# EAGLE schematic WirelessSensorPacket - Copy (EAGLE 6.4)

## Sheet 1 of 4

## Sheet 2 of 4
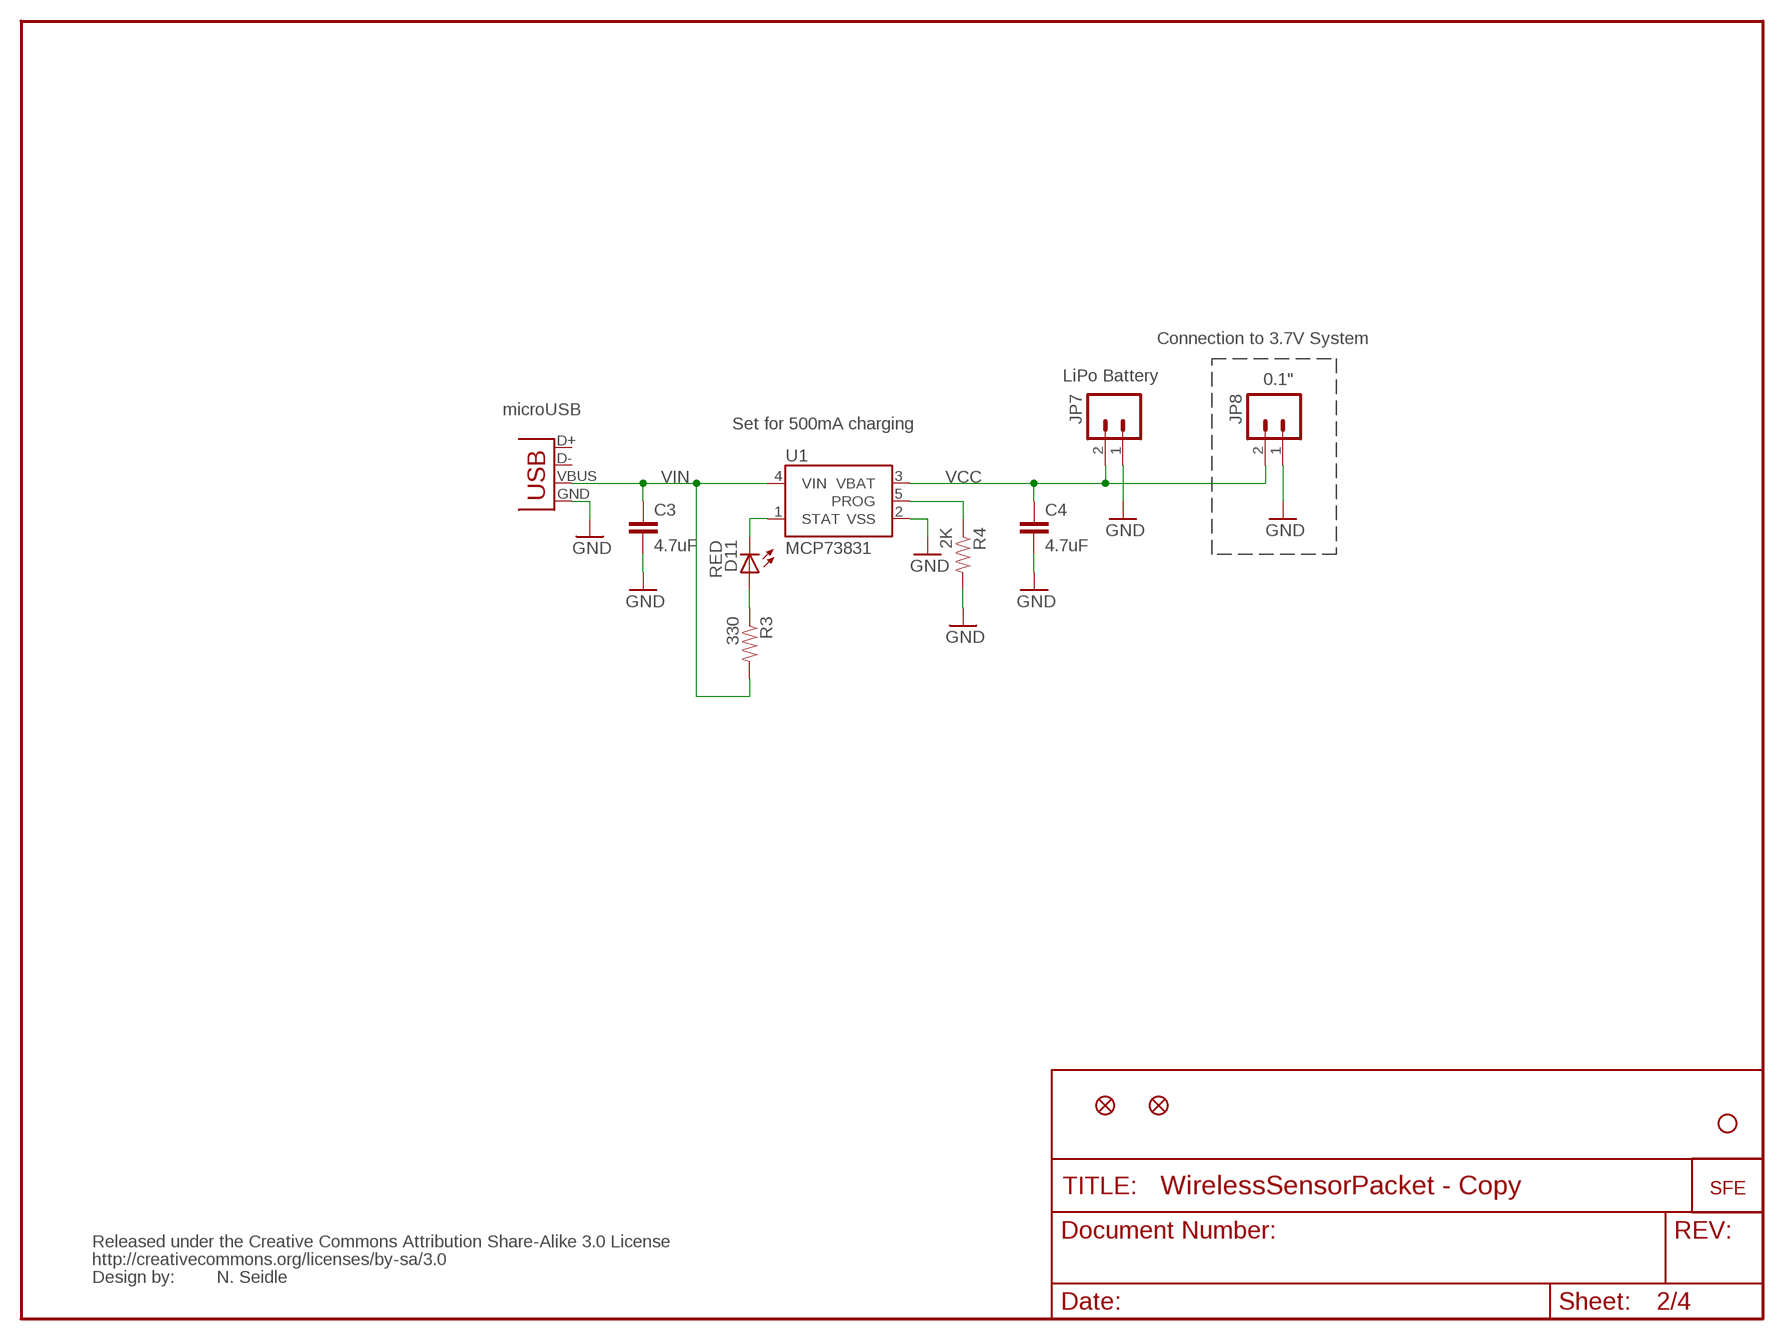
[diagram p0: schematic, sheet 2]

### Parts
C3  4.7uF  CAP0402-CAP  [0402-CAP]
C4  4.7uF  CAP0402-CAP  [0402-CAP]
D11  RED  LED0603  [LED-0603]
JP1  LOGO-SFESK  [SFE-LOGO-FLAME]
JP2  STAND-OFF  [STAND-OFF]
JP3  FIDUCIAL1X2  [FIDUCIAL-1X2]
JP4  FIDUCIAL1X2  [FIDUCIAL-1X2]
JP7  LiPo Battery  M02-JST-2MM-SMT  [JST-2-SMD]
JP8  M02PTH  [1X02]
R3  330  RESISTOR0402-RES  [0402-RES]
R4  2K  RESISTOR0402-RES  [0402-RES]
U1  MCP73831  [SOT23-5]
U$1  CREATIVE_COMMONS  [CREATIVE_COMMONS]
X1  Micro USB  USB-MICROB  [USB-MICROB]

### Nets
GND: C3.2 C4.2 JP7.1 JP8.1 R4.2 U1.2(VSS) X1.GND ; also sheet 3,4
N$3: D11.A R3.1
PROG: R4.1 U1.5(PROG)
STAT: D11.C U1.1(STAT)
VCC: C4.1 JP7.2 JP8.2 U1.3(VBAT)
VIN: C3.1 R3.2 U1.4(VIN) X1.VBUS
Unconnected: X1.D+ X1.D-

### Notes on the sheet
- Connection to 3.7V System
- 0.1"
- microUSB
- Set for 500mA charging
- N. Seidle

## Sheet 3 of 4
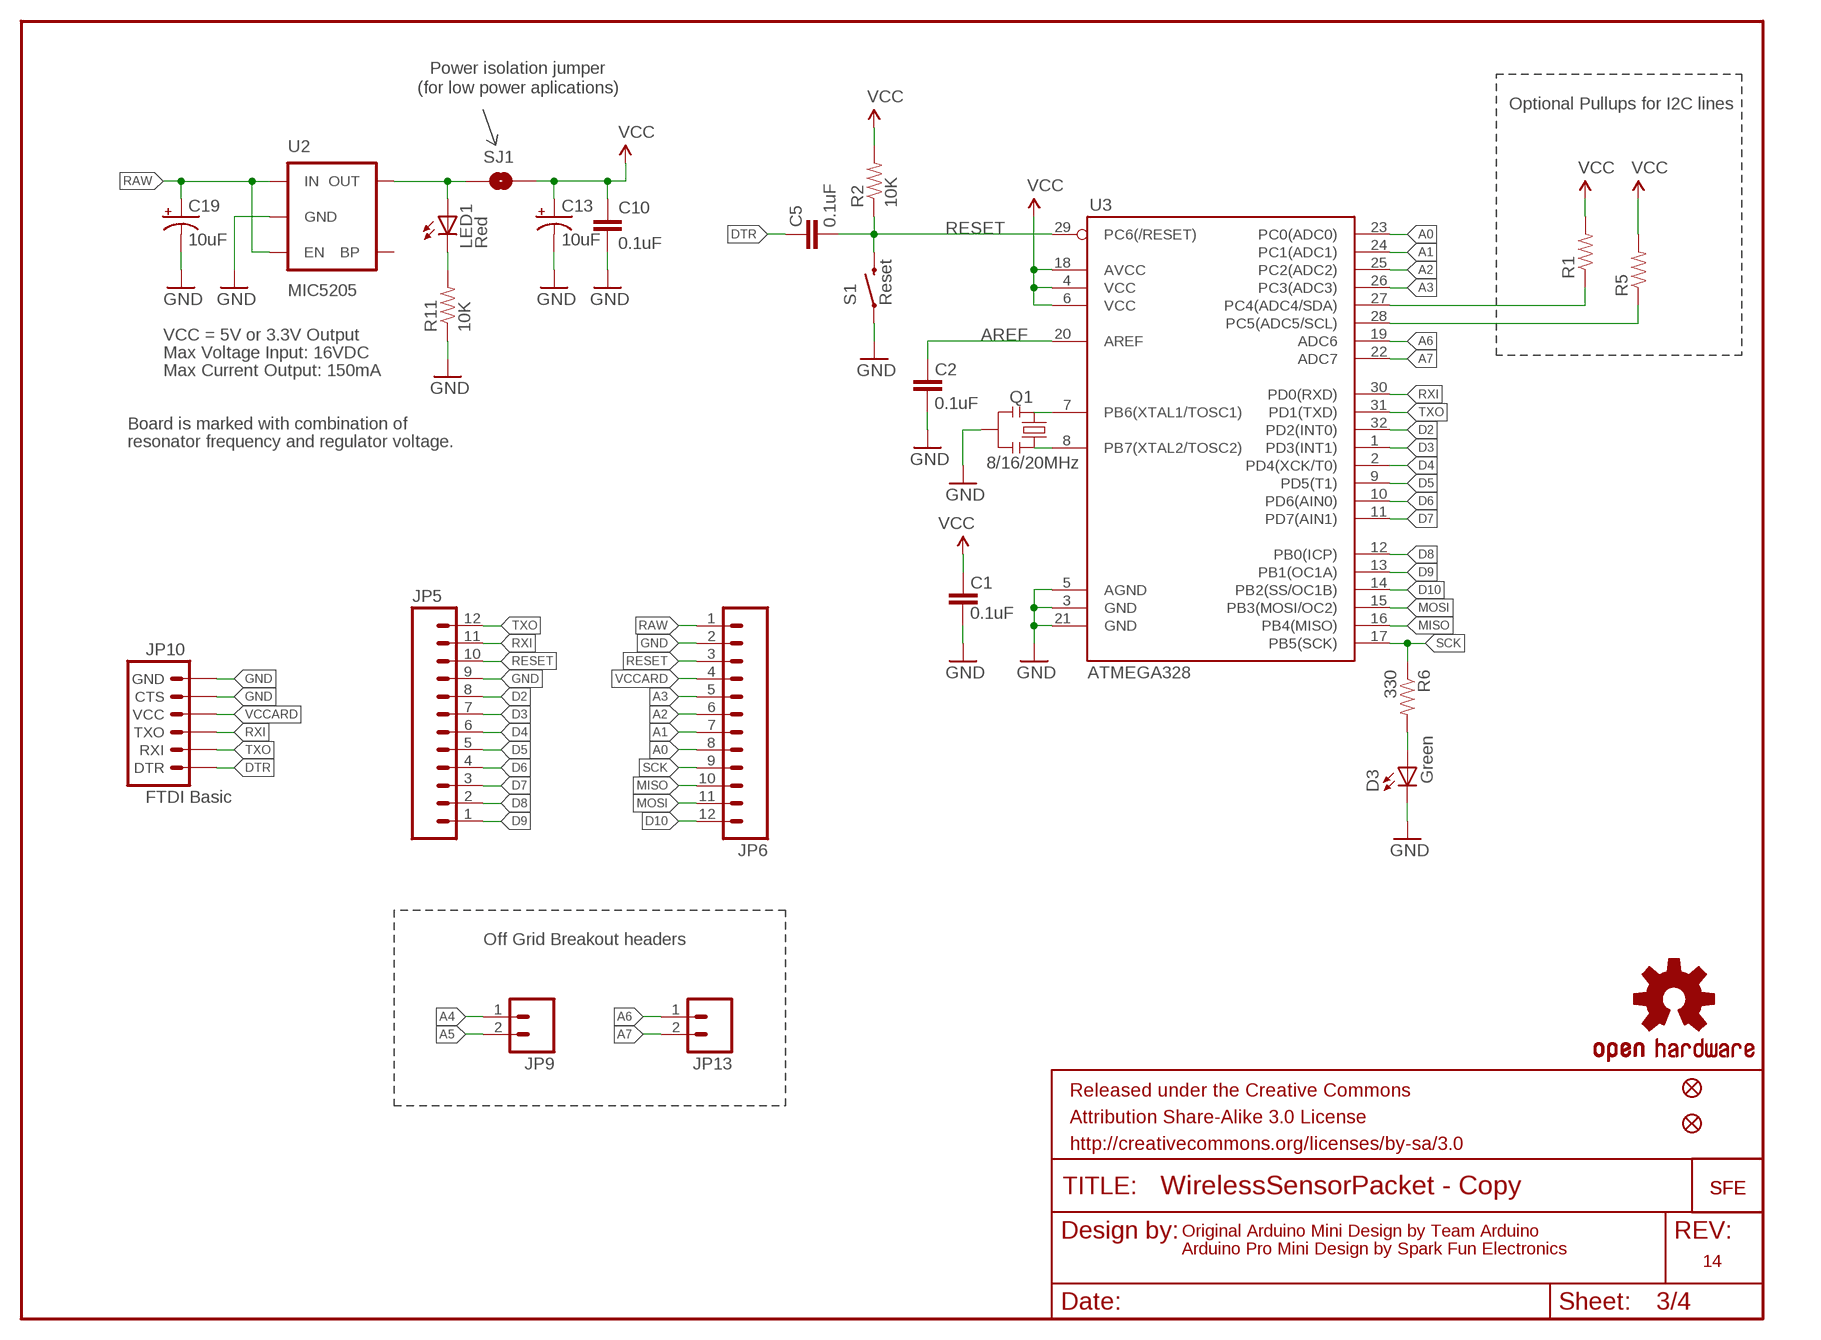
[diagram p1: schematic, sheet 3]

### Parts
C1  0.1uF  CAP0603-CAP  [0603-CAP]
C2  0.1uF  CAP0603-CAP  [0603-CAP]
C5  0.1uF  CAP0603-CAP  [0603-CAP]
C10  0.1uF  CAP0603-CAP  [0603-CAP]
C13  10uF  CAP_POL1206  [EIA3216]
C19  10uF  CAP_POL1206  [EIA3216]
D3  Green  LED  [0603-LED-ALT1]
JP5  M12PTH  [1X12]
JP6  M12PTH  [1X12]
JP9  M02PTH  [1X02]
JP10  FTDI Basic  ARDUINO_SERIAL_PROGRAMPTH  [1X06]
JP11  FIDUCIALUFIDUCIAL  [MICRO-FIDUCIAL]
JP12  FIDUCIALUFIDUCIAL  [MICRO-FIDUCIAL]
JP13  M02PTH  [1X02]
LED1  Red  LED  [0603-LED-ALT1]
Q1  8/16/20MHz  RESONATOR1:1  [RESONATOR-SMD-1:1]
R1  RESISTOR0603-RES  [0603-RES]
R2  10K  RESISTOR0603-RES  [0603-RES]
R5  RESISTOR0603-RES  [0603-RES]
R6  330  RESISTOR0603-RES  [0603-RES]
R11  10K  RESISTOR0603-RES  [0603-RES]
S1  Reset  SWITCH-MOMENTARY-2SMD-ALT01  [TACTILE-SWITCH-SMD-ALT01]
SJ1  SOLDERJUMPERNC  [SJ_2S]
U2  MIC5205  V_REG_LDOSMD  [SOT23-5]
U3  ATMEGA328  ATMEGA168  [TQFP32-08]
U$2  LOGO-SFESK  [SFE-LOGO-FLAME]
U$3  OSHW-LOGOS  [OSHW-LOGO-S]
U$11  LOGO-SFENEW  [SFE-NEW-WEBLOGO]

### Nets
A0: JP6.8 U3.23(PC0(ADC0))
A1: JP6.7 U3.24(PC1(ADC1))
A2: JP6.6 U3.25(PC2(ADC2))
A3: JP6.5 U3.26(PC3(ADC3))
A4: JP9.1 R1.1 U3.27(PC4(ADC4/SDA))
A5: JP9.2 R5.1 U3.28(PC5(ADC5/SCL))
A6: JP13.1 U3.19(ADC6)
A7: JP13.2 U3.22(ADC7)
AREF: C2.2 U3.20(AREF)
D2: JP5.8 U3.32(PD2(INT0))
D3: JP5.7 U3.1(PD3(INT1))
D4: JP5.6 U3.2(PD4(XCK/T0))
D5: JP5.5 U3.9(PD5(T1))
D6: JP5.4 U3.10(PD6(AIN0))
D7: JP5.3 U3.11(PD7(AIN1))
D8: JP5.2 U3.12(PB0(ICP))
D9: JP5.1 U3.13(PB1(OC1A))
D10: JP6.12 U3.14(PB2(SS/OC1B))
DTR: C5.2 JP10.1(DTR)
GND: C1.1 C2.1 C10.2 C13.C(-) C19.C(-) D3.C JP5.9 JP6.2 JP10.5(CTS) JP10.6(GND) Q1.2 R11.1 S1.1 S1.2 U2.2(GND) U3.3(GND) U3.5(AGND) U3.21(GND) ; also sheet 2,4
MISO: JP6.10 U3.16(PB4(MISO))
MOSI: JP6.11 U3.15(PB3(MOSI/OC2))
N$1: Q1.3 U3.8(PB7(XTAL2/TOSC2))
N$2: Q1.1 U3.7(PB6(XTAL1/TOSC1))
N$4: LED1.A SJ1.1 U2.5(OUT)
N$5: LED1.C R11.2
N$7: D3.A R6.2
RAW [vcc]: C19.A(+) JP6.1 U2.1(IN) U2.3(EN)
RESET: C5.1 JP5.10 JP6.3 R2.1 S1.3 S1.4 U3.29(PC6(/RESET))
RXI: JP5.11 JP10.3(TXO) U3.30(PD0(RXD))
SCK: JP6.9 R6.1 U3.17(PB5(SCK))
TXO: JP5.12 JP10.2(RXI) U3.31(PD1(TXD))
VCCARD: C1.2 C10.1 C13.A(+) JP6.4 JP10.4(VCC) R1.2 R2.2 R5.2 SJ1.2 U3.4(VCC) U3.6(VCC) U3.18(AVCC) ; supply symbol labelled VCC
Unconnected: U2.4(BP)

### Notes on the sheet
- Power isolation jumper
- (for low power aplications)
- Optional Pullups for I2C lines
- VCC = 5V or 3.3V Output
- Max Voltage Input: 16VDC
- Max Current Output: 150mA
- Board is marked with combination of
- resonator frequency and regulator voltage.
- Off Grid Breakout headers
- Original Arduino Mini Design by Team Arduino
- Arduino Pro Mini Design by Spark Fun Electronics
- 14

## Sheet 4 of 4
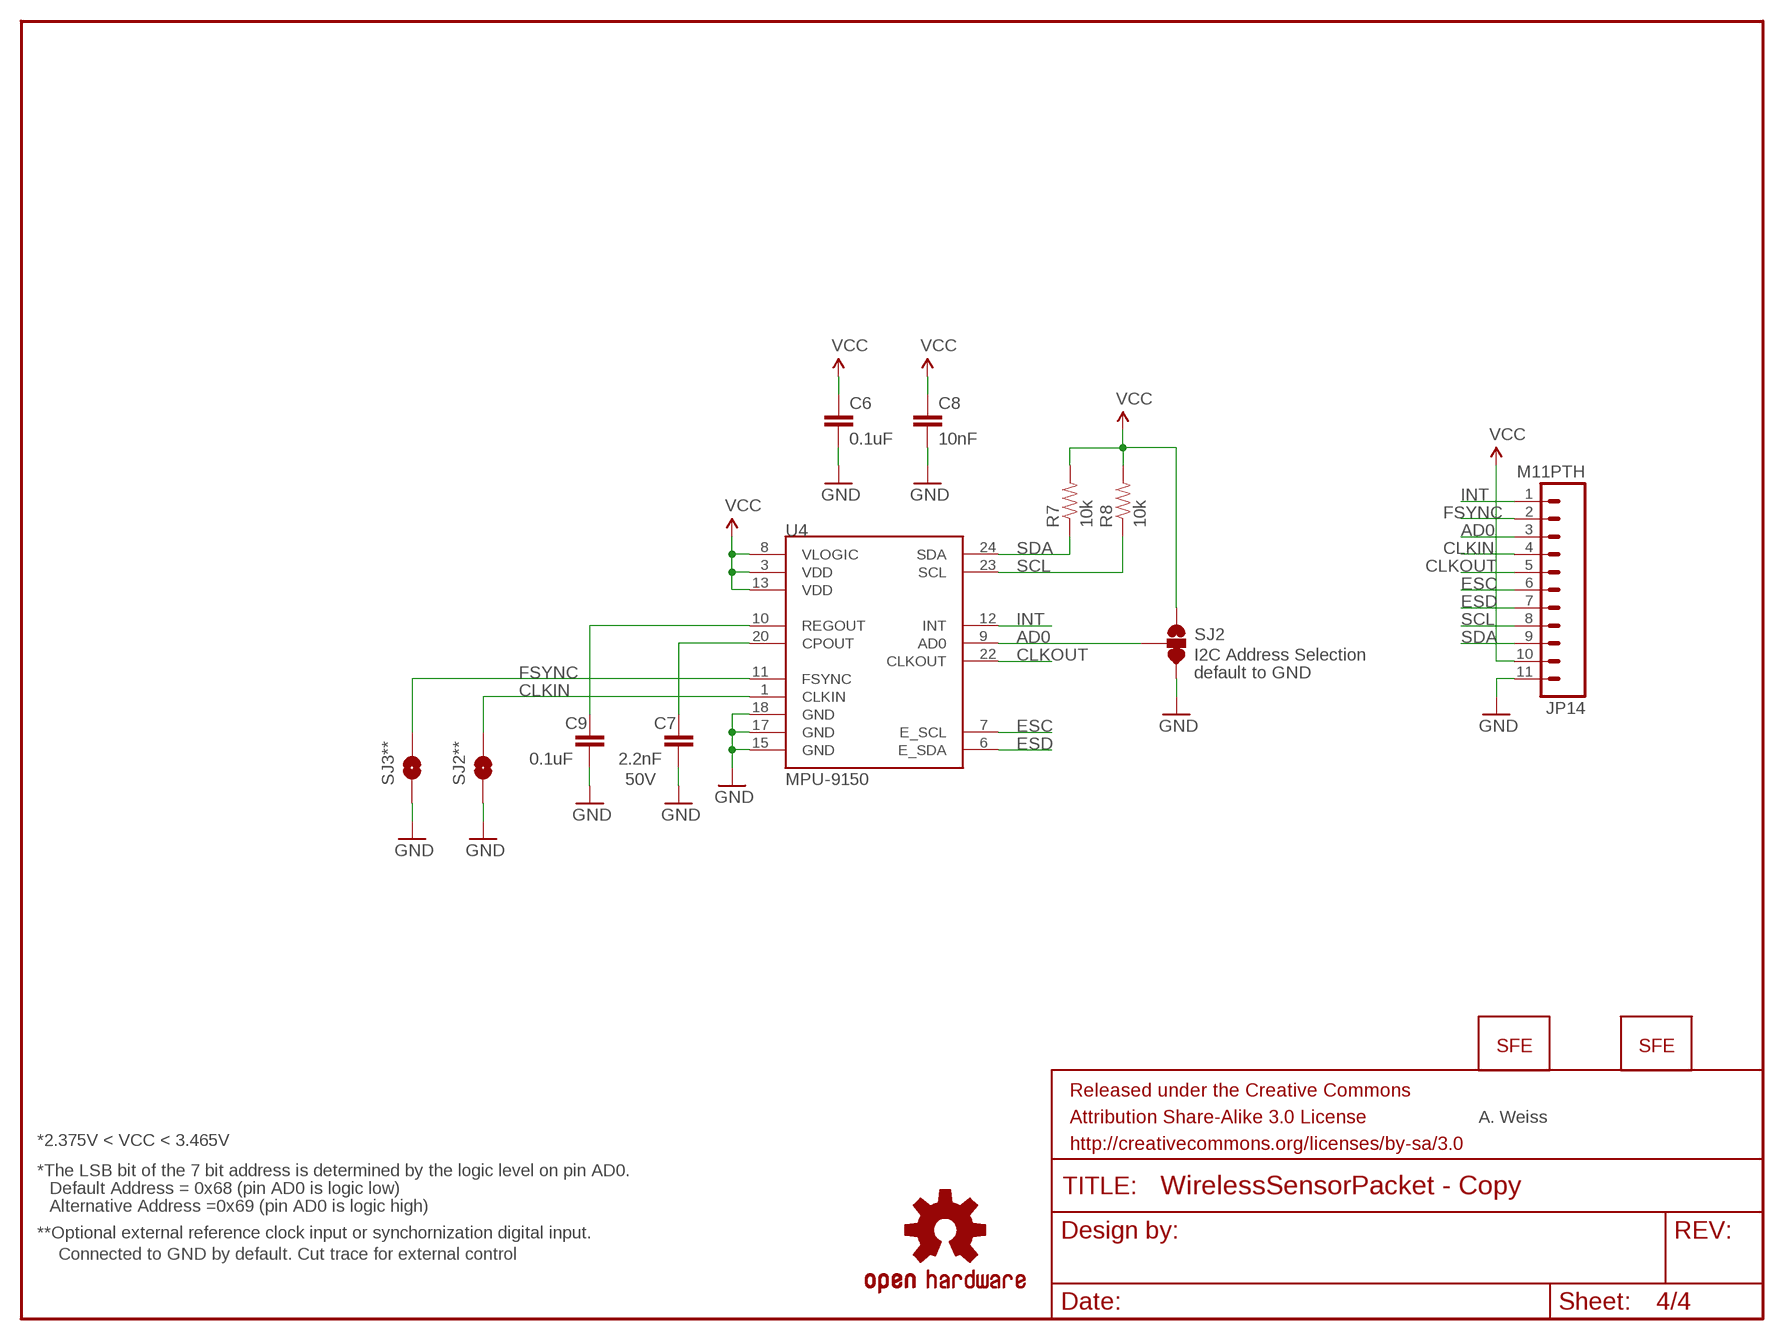
[diagram p2: schematic, sheet 4]

### Parts
C6  0.1uF  CAP0402-CAP  [0402-CAP]
C7  2.2nF  CAP0402-CAP  [0402-CAP]
C8  10nF  CAP0402-CAP  [0402-CAP]
C9  0.1uF  CAP0402-CAP  [0402-CAP]
JP14  M11PTH  [1X11]
JP17  LOGO-SFENW2  [SFE-NEW-WEB]
JP18  LOGO-SFESK  [SFE-LOGO-FLAME]
R7  10k  RESISTOR0402-RES  [0402-RES]
R8  10k  RESISTOR0402-RES  [0402-RES]
SJ2  SOLDERJUMPER_2WAYPASTE2&3  [SJ_3_PASTE2&3]
SJ2**  SOLDERJUMPERTRACE  [SJ_2S-TRACE]
SJ3**  SOLDERJUMPERTRACE  [SJ_2S-TRACE]
U4  MPU-9150  MPU-9150QFN-24-NP  [QFN-24-NP]
U$4  OSHW-LOGOS  [OSHW-LOGO-S]

### Nets
AD0: JP14.3 SJ2.2 U4.9(AD0)
CLKIN: JP14.4 SJ2**.2 U4.1(CLKIN)
CLKOUT: JP14.5 U4.22(CLKOUT)
ESC: JP14.6 U4.7(E_SCL)
ESD: JP14.7 U4.6(E_SDA)
FSYNC: JP14.2 SJ3**.2 U4.11(FSYNC)
GND: C6.2 C7.2 C8.2 C9.2 JP14.11 SJ2**.1 SJ2.3 SJ3**.1 U4.15(GND) U4.17(GND) U4.18(GND) ; also sheet 2,3
INT: JP14.1 U4.12(INT)
N$6: C7.1 U4.20(CPOUT)
N$8: C9.1 U4.10(REGOUT)
SCL: JP14.8 R8.1 U4.23(SCL)
SDA: JP14.9 R7.1 U4.24(SDA)
VCCMPU: C6.1 C8.1 JP14.10 R7.2 R8.2 SJ2.1 U4.3(VDD) U4.8(VLOGIC) U4.13(VDD) ; supply symbol labelled VCC

### Notes on the sheet
- I2C Address Selection
- default to GND
- 50V
- A. Weiss
- *2.375V < VCC < 3.465V
- *The LSB bit of the 7 bit address is determined by the logic level on pin AD0.
- Default Address = 0x68 (pin AD0 is logic low)
- Alternative Address =0x69 (pin AD0 is logic high)
- **Optional external reference clock input or synchornization digital input.
- Connected to GND by default. Cut trace for external control

## Library data of the parts
C1-C5 C10 = SparkFun:CAP: Capacitor Standard 0603 ceramic capacitor, and 0.1" leaded capacitor.
C6-C9 = SparkFun-Passives:CAP: Capacitor Standard 0603 ceramic capacitor, and 0.1" leaded capacitor.
C13 C19 = SparkFun:CAP_POL: Capacitor Polarized These are standard SMD and PTH capacitors. Normally 10uF, 47uF, and 100uF in electrolytic and tantalum varieties. Always verify the external diameter of the through hole cap, it varies with capacity, voltage, and manufacturer. The EIA devices should be standard.
D3 LED1 = Testing:LED: LEDs Standard schematic elements and footprints for 5mm, 3mm, 1206, and 0603 sized LEDs. 5mm - Spark Fun Electronics SKU : COM-00529 (and others)
D11 = SparkFun:LED: LEDs Standard schematic elements and footprints for 5mm, 3mm, 1206, and 0603 sized LEDs. 5mm - Spark Fun Electronics SKU : COM-00529 (and others)
JP1 U$2 U$11 = SparkFun:LOGO-SFE: Spark Fun Electronics PCB Logo This is the standard Spark Fun Electronics PCB logo.
JP2 = SparkFun:STAND-OFF: Stand Off This is the mechanical footprint for a #4 phillips button head screw. Use the keepout ring to avoid running the screw head into surrounding components. SKU : PRT-00447
JP3 JP4 JP11 JP12 = SparkFun:FIDUCIAL: Fiducial Alignment Points Various fiducial points for machine vision alignment.
JP5 JP6 = SparkFun:M12: Header 12 Standard 12-pin 0.1" header. Use with straight break away headers (SKU : PRT-00116), right angle break away headers (PRT-00553), swiss pins (PRT-00743), machine pins (PRT-00117), and female headers (PRT-00115).
JP7-JP9 JP13 = SparkFun:M02: Header 2 Standard 2-pin 0.1" header. Use with straight break away headers (SKU : PRT-00116), right angle break away headers (PRT-00553), swiss pins (PRT-00743), machine pins (PRT-00117), and female headers (PRT-00115). Molex polarized connector foot print use with SKU : PRT-08233 with associated crimp pins and housings.
JP10 = SparkFun:ARDUINO_SERIAL_PROGRAM
JP14 = SparkFun-Connectors:M11: Header 11 Standard 11-pin 0.1" header. Use with straight break away headers (SKU : PRT-00116), right angle break away headers (PRT-00553), swiss pins (PRT-00743), machine pins (PRT-00117), and female headers (PRT-00115).
JP17 JP18 = SparkFun-Aesthetics:LOGO-SFE: Spark Fun Electronics PCB Logo This is the standard Spark Fun Electronics PCB logo.
Q1 = Testing:RESONATOR: Resonator Small SMD resonator. This is the itty bitty 10/20MHz resonators with built in caps. CSTCE10M0G55 and CSTCE20M0V53. Footprint for SMD has been used in SFE production for years, and does work okay. 1:1 is an attempt to get larger fillets on the sides so it will be easier to inspect these solders in our AOI machine. The pads have been minimized to match the actual metal under the resonator. To see this relation, it includes an image import of the bottom side of the component. Imported to scale on layer 200.
R1-R6 R11 = SparkFun:RESISTOR: Resistor Basic schematic elements and footprints for 0603, 1206, and PTH resistors.
R7 R8 = SparkFun-Passives:RESISTOR: Resistor Basic schematic elements and footprints for 0603, 1206, and PTH resistors.
S1 = Testing:SWITCH-MOMENTARY-2: Various NO switches- pushbuttons, reed, etc
SJ1 SJ2** SJ3** = SparkFun-Passives:SOLDERJUMPER: Solder Jumper Standard SMD solder jumper. Used to automate production. Two varients : Normally Open and Normally Closed are the same, but have different paste layers. NC will have a large amount of paste and should jumper during reflow.
SJ2 = SparkFun-Passives:SOLDERJUMPER_2WAY: Solder Jumper 2 way solder jumper
U1 = SparkFun:MCP73831: Microchip's MCP73831 Miniature single cell, fully integrated Li-Ion, Li-polymer charge management controller http://ww1.microchip.com/downloads/en/DeviceDoc/21984a.pdf
U2 = SparkFun:V_REG_LDO: Voltage Regulator LDO Standard 150mA LDO voltage regulator in SOT-23 layout. Micrel part MIC5205. BP (by-pass) pin is used to lower output noise with 470pF cap.
U3 = SparkFun:ATMEGA168
U4 = SparkFun-Sensors:MPU-9150: 9DOF (3mag, 3accel, 3rotat). I2C interface.
U$1 = SparkFun:CREATIVE_COMMONS
U$3 = SparkFun:OSHW-LOGO: Open Source Hardware Logo This logo indicates the piece of hardware it is found on incorporates a OSHW license and/or adheres to the definition of open source hardware found here: http://freedomdefined.org/OSHW
U$4 = SparkFun-Aesthetics:OSHW-LOGO: Open Source Hardware Logo This logo indicates the piece of hardware it is found on incorporates a OSHW license and/or adheres to the definition of open source hardware found here: http://freedomdefined.org/OSHW
X1 = SparkFun:USB: USB Connectors USB-B-PTH is fully proven SKU : PRT-00139 USB-miniB is fully proven SKU : PRT-00587 USB-A-PCB is untested. USB-A-H is throughly reviewed, but untested. Spark Fun Electronics SKU : PRT-00437 USB-B-SMT is throughly reviewed, but untested. Needs silkscreen touching up. USB-A-S has not been used/tested USB-MB-H has not been used/tested

## Net classes
1 vcc: width 0.254 mm